# Altium schematic sheet GPIO_EXTENDER.SchDoc
size A3; DocumentNumber: 8; SheetNumber: 8; SheetTotal: 9
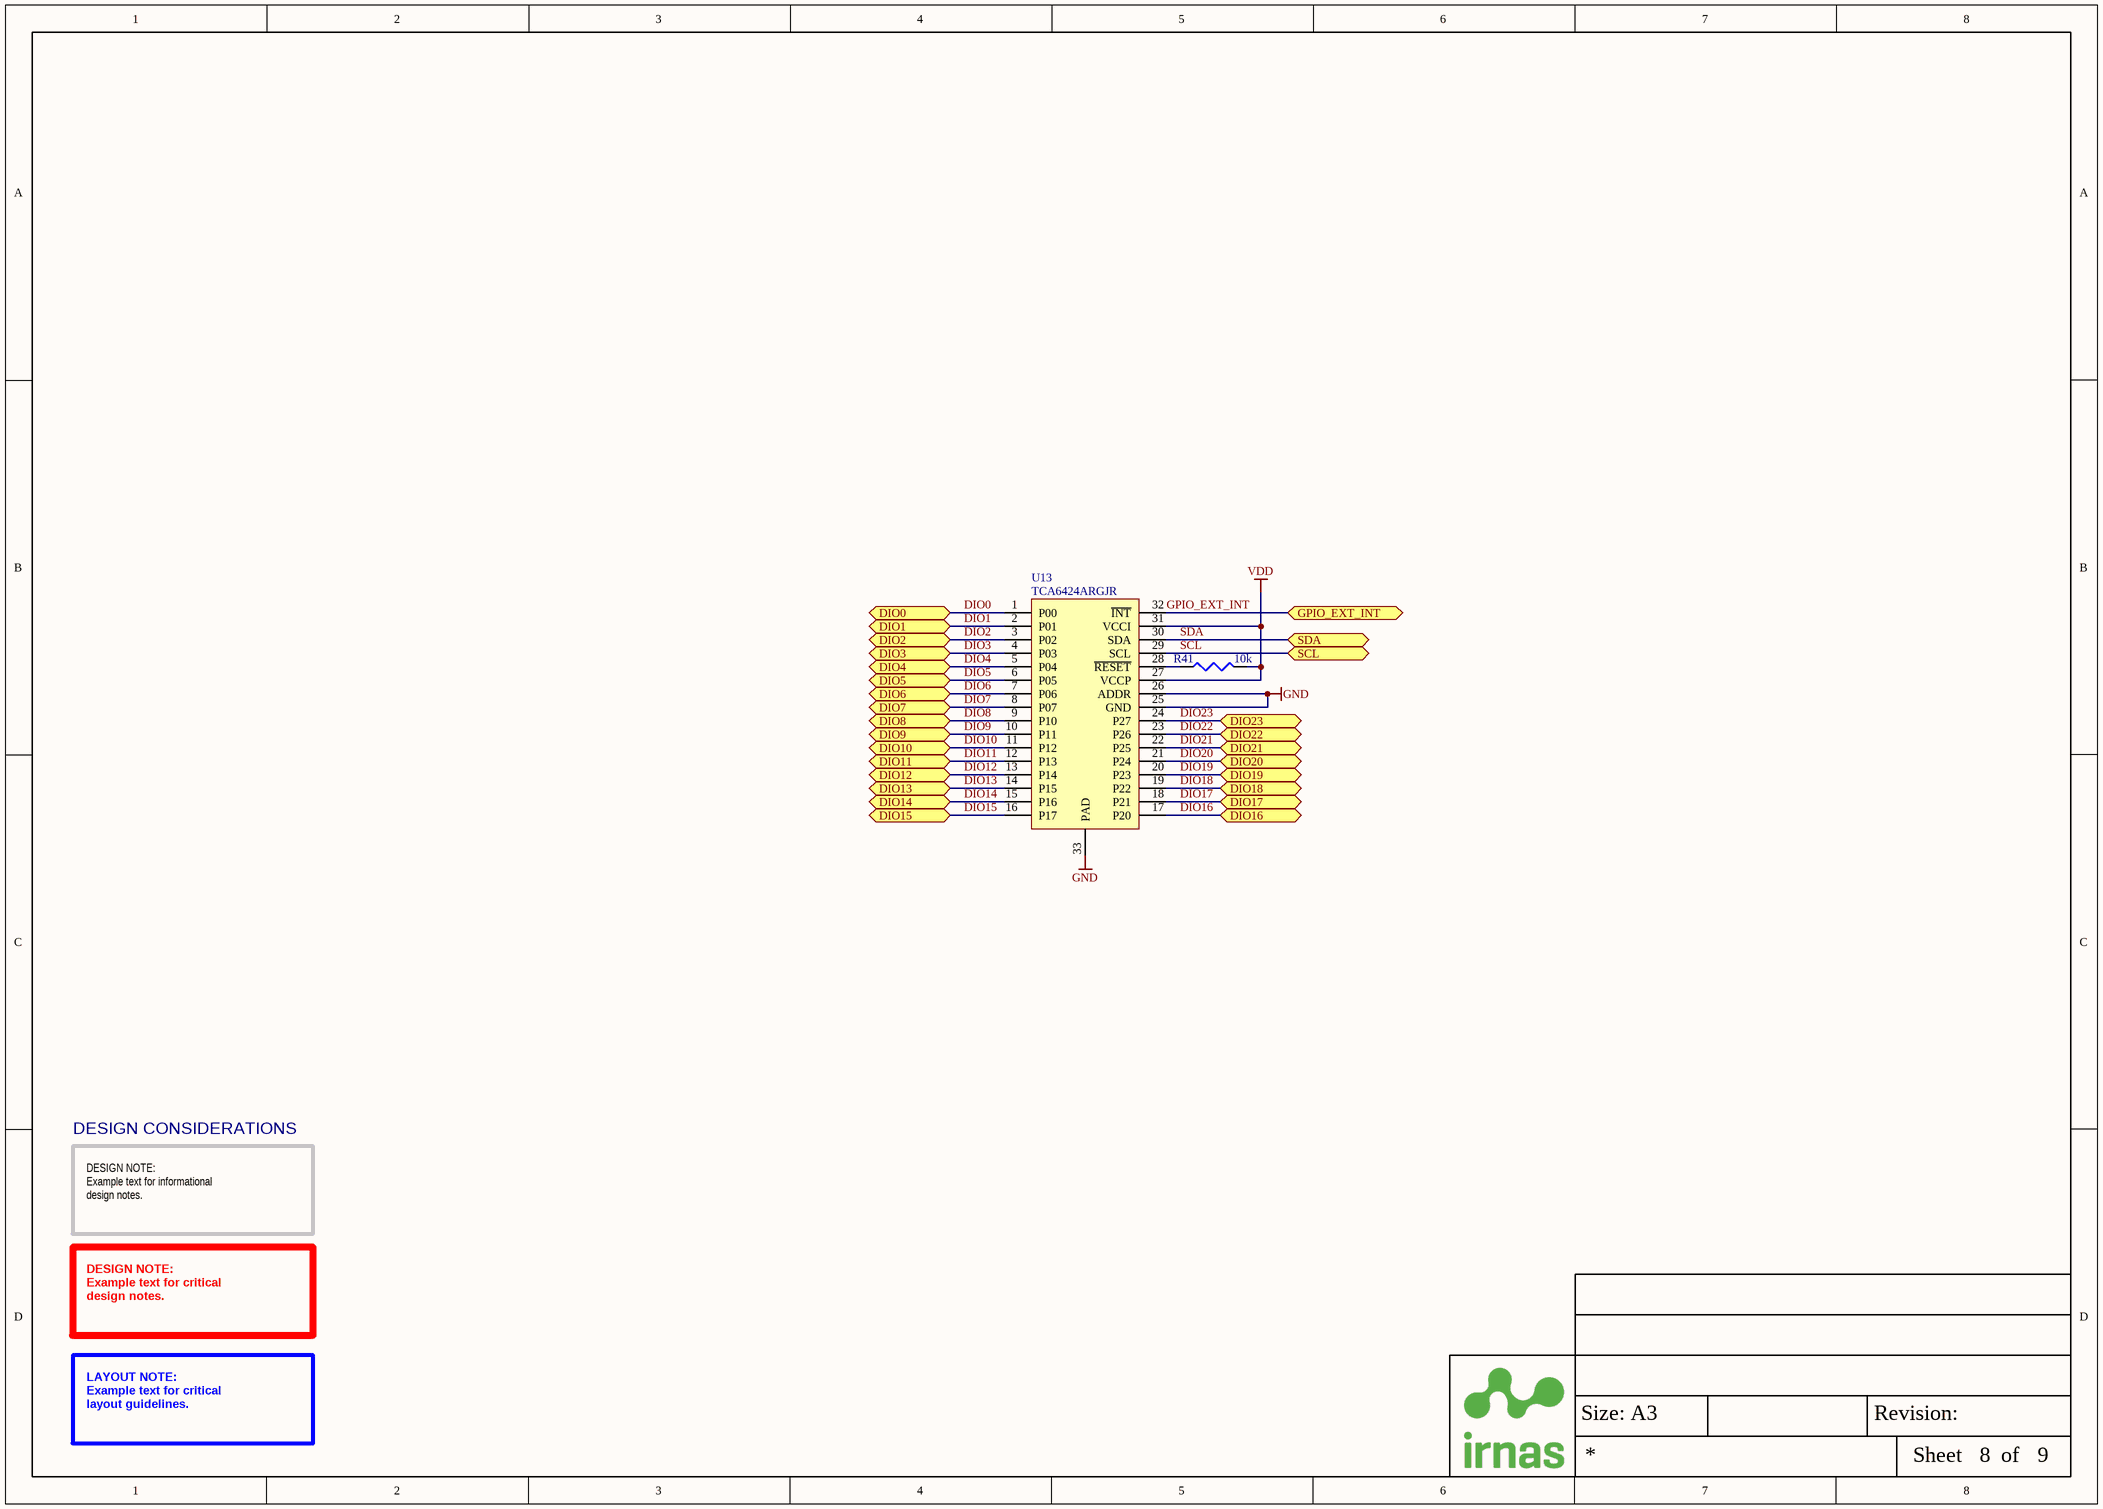
[diagram p0: GPIO_EXTENDER.SchDoc]

## Parts
R41  10k  [RES0402]
U13  TCA6424ARGJR  [UQFN 32]

## Ports
DIO0 (bidir), DIO1 (bidir), DIO2 (bidir), DIO3 (bidir), DIO4 (bidir), DIO5 (bidir), DIO6 (bidir), DIO7 (bidir), DIO8 (bidir), DIO9 (bidir), DIO10 (bidir), DIO11 (bidir), DIO12 (bidir), DIO13 (bidir), DIO14 (bidir), DIO15 (bidir), DIO16 (bidir), DIO17 (bidir), DIO18 (bidir), DIO19 (bidir), DIO20 (bidir), DIO21 (bidir), DIO22 (bidir), DIO23 (bidir), GPIO_EXT_INT (bidir), SCL (bidir), SDA (bidir)

## Nets
GND: U13.25(GND) U13.26(ADDR) U13.33(PAD)
VDD: R41.2 U13.27(VCCP) U13.31(VCCI)
DIO0: U13.1(P00) ; port DIO0
DIO1: U13.2(P01) ; port DIO1
DIO2: U13.3(P02) ; port DIO2
DIO3: U13.4(P03) ; port DIO3
DIO4: U13.5(P04) ; port DIO4
DIO5: U13.6(P05) ; port DIO5
DIO6: U13.7(P06) ; port DIO6
DIO7: U13.8(P07) ; port DIO7
DIO8: U13.9(P10) ; port DIO8
DIO9: U13.10(P11) ; port DIO9
DIO10: U13.11(P12) ; port DIO10
DIO11: U13.12(P13) ; port DIO11
DIO12: U13.13(P14) ; port DIO12
DIO13: U13.14(P15) ; port DIO13
DIO14: U13.15(P16) ; port DIO14
DIO15: U13.16(P17) ; port DIO15
DIO16: U13.17(P20) ; port DIO16
DIO17: U13.18(P21) ; port DIO17
DIO18: U13.19(P22) ; port DIO18
DIO19: U13.20(P23) ; port DIO19
DIO20: U13.21(P24) ; port DIO20
DIO21: U13.22(P25) ; port DIO21
DIO22: U13.23(P26) ; port DIO22
DIO23: U13.24(P27) ; port DIO23
GPIO_EXT_INT: U13.32(~{INT}) ; port GPIO_EXT_INT
SCL: U13.29(SCL) ; port SCL
SDA: U13.30(SDA) ; port SDA
NetR41_1: R41.1 U13.28(~{RESET})

## Notes on the sheet
- DESIGN CONSIDERATIONS
- DESIGN NOTE:
  Example text for informational
  design notes.
- DESIGN NOTE:
  Example text for critical
  design notes.
- LAYOUT NOTE:
  Example text for critical
  layout guidelines.
- Size: A3
- Revision:
- Sheet
- of

## Library data of the parts
R41 = R - 10k/0402: MULTICOMP         MCWR04X1002FTL             SMD Chip Resistor, Thick Film, 10 kohm, 50 V, 0402 [1005 Metric], 62.5 mW,  1%, MCWR Series; IRNAS Part No.: I-100014; Resistance: 10kR; Voltage Rating: 50V; Power Rating: 62.5mW; Temperature Coefficient: 100ppm/°C; Supplier 1: Farnell; Manufacturer: Multicomp; Manufacturer Part Number: MCWR04X1002FTL; Stock 1: 602609; Pricing 1: 10=0.0029, 100=0.0017, 500=0.0012, 2500=0.001, 5000=0.0008 (EUR); Case/Package: 0402; Case Code (Metric): 1005; Case Code (Imperial): 0402; Packaging: Cut Tape; Composition: Thick Film; Tolerance: 1%; Voltage Rating (DC): 50V; REACH SVHC: No SVHC; ComponentLink1URL: http://www.farnell.com/datasheets/1849611.pdf; ComponentLink1Description: http://www.farnell.com/datasheets/1849611.pdf; Supplier Part Number 1: 2447096
U13 = INT - TCA6424ARGJR: I/O Expander, 24bit, 400 kHz, I2C, SMBus, 1.65 V, 5.5 V, UQFN; Supplier 1: Farnell; Supplier Part Number 1: 2308700; ComponentLink1Description: Datasheet; ComponentLink1URL: http://www.ti.com/lit/ds/symlink/tca6424a.pdf